# Altium schematic sheet XH-2PA (white connector).schdoc
size 124 x 99 mm
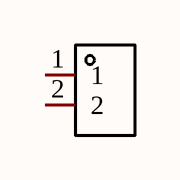
[diagram p0: XH-2PA (white connector).schdoc]

## Parts
U?  XH-2PA  [CONN-TH_XH-2A]  (value not drawn)

## Nets

Not connected (* = marked no-connect by the designer): U? 1 2

## Library data of the parts
U? = XH-2PA: Manufacturer: ZHOURI(洲日); Add into BOM: yes; Symbol: XH-2PA; Device: XH-2PA; LCSC Part Name: XH-2PA; Supplier Part: C5258883; Manufacturer Part: XH-2PA; Supplier Footprint: 插件,P=2.5mm; JLCPCB Part Class: Extended Part; Datasheet: https://atta.szlcsc.com/upload/public/pdf/source/20221111/941C48A64A881023E1ECD9BB647261A0.pdf; Supplier: LCSC; Convert to PCB: yes